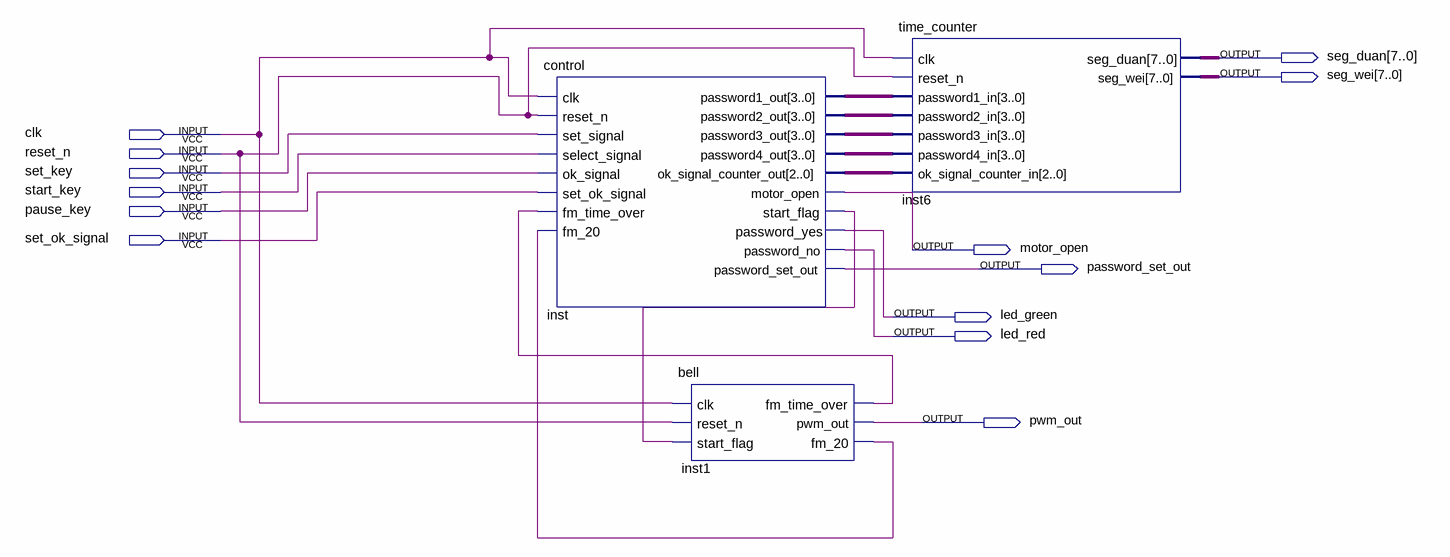
[diagram p0: schematic sheet]
// Quartus schematic time.bdf as structural Verilog: 3 symbols, 13 pins
module \time  (
  input  clk,
  input  reset_n,
  input  set_key,
  input  start_key,
  input  pause_key,
  input  set_ok_signal,
  output [7:0] seg_duan,
  output [7:0] seg_wei,
  output motor_open,
  output password_set_out,
  output led_green,
  output led_red,
  output pwm_out
);

  wire inst1_fm_20, inst1_fm_time_over, inst_start_flag;
  wire [2:0] inst_ok_signal_counter_out;
  wire [3:0] inst_password1_out, inst_password2_out, inst_password3_out, inst_password4_out;

  control inst (
    .clk(clk), .reset_n(reset_n), .set_signal(set_key), .select_signal(start_key), .ok_signal(pause_key),
    .set_ok_signal(set_ok_signal), .fm_time_over(inst1_fm_time_over), .fm_20(inst1_fm_20),
    .password1_out(inst_password1_out), .password2_out(inst_password2_out),
    .password3_out(inst_password3_out), .password4_out(inst_password4_out),
    .ok_signal_counter_out(inst_ok_signal_counter_out), .motor_open(motor_open),
    .start_flag(inst_start_flag), .password_yes(led_green), .password_no(led_red),
    .password_set_out(password_set_out));
  bell inst1 (
    .clk(clk), .reset_n(reset_n), .start_flag(inst_start_flag), .fm_time_over(inst1_fm_time_over),
    .pwm_out(pwm_out), .fm_20(inst1_fm_20));
  time_counter inst6 (
    .clk(clk), .reset_n(reset_n), .password1_in(inst_password1_out), .password2_in(inst_password2_out),
    .password3_in(inst_password3_out), .password4_in(inst_password4_out),
    .ok_signal_counter_in(inst_ok_signal_counter_out), .seg_duan(seg_duan), .seg_wei(seg_wei));
endmodule
